# EAGLE design fencerSMD (EAGLE 8.1.0)
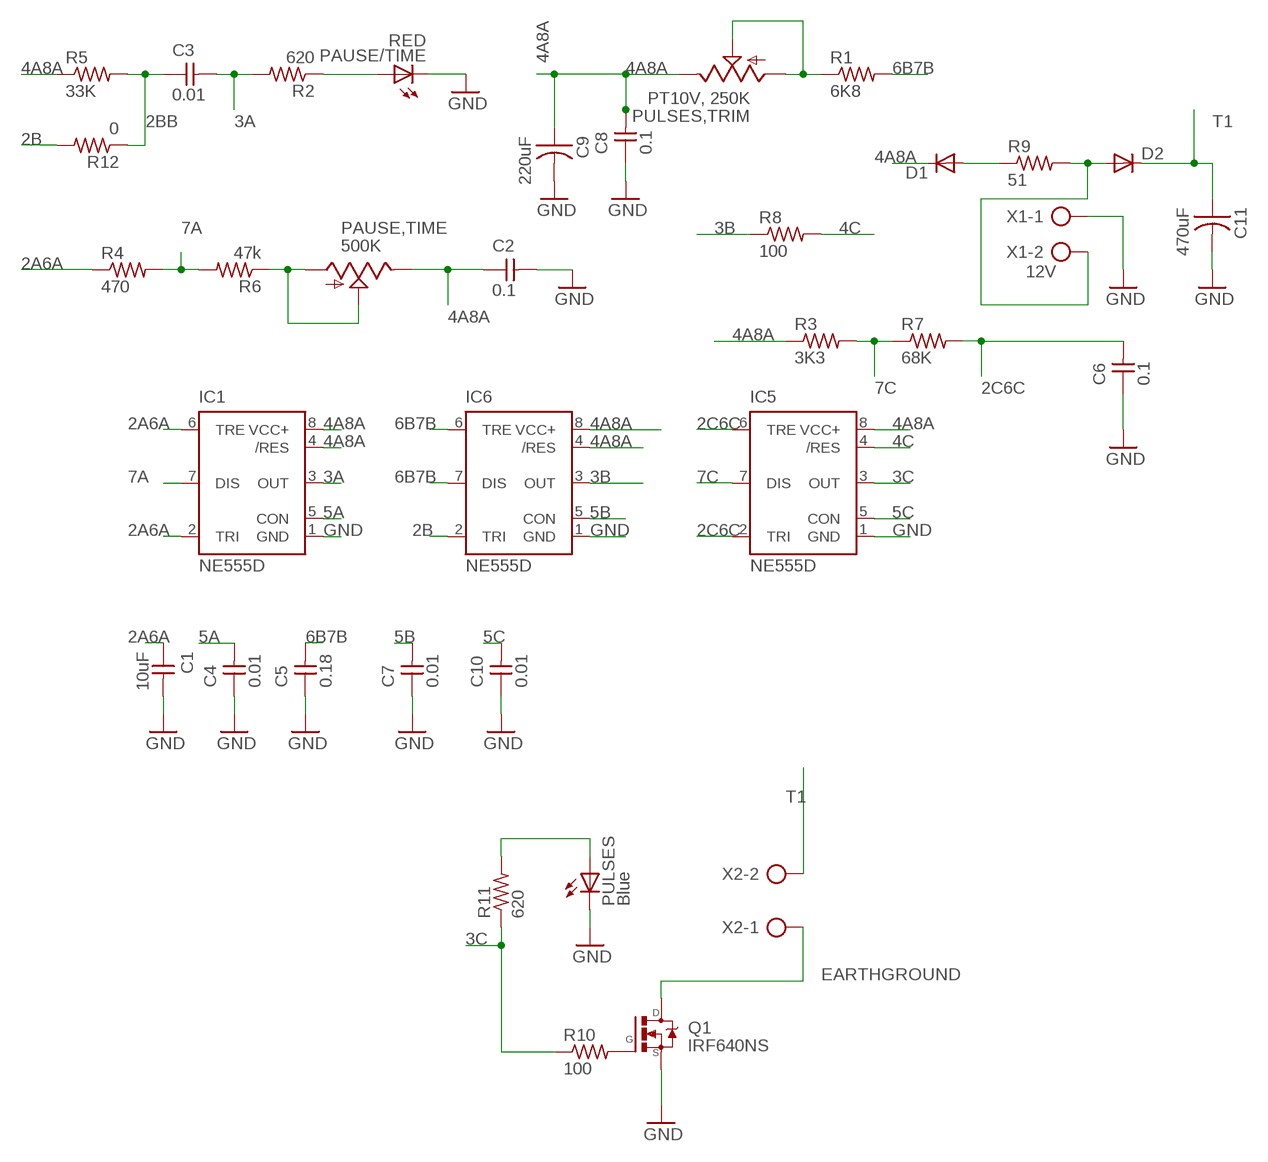
[diagram p0: schematic, sheet 1]

## Parts
C1  10uF  UNPOLARIZED_CAPACITOR1206  [1206]
C2  0.1  UNPOLARIZED_CAPACITOR1206  [1206]
C3  0.01  UNPOLARIZED_CAPACITOR1206  [1206]
C4  0.01  UNPOLARIZED_CAPACITOR1206  [1206]
C5  0.18  UNPOLARIZED_CAPACITOR1206  [1206]
C6  0.1  UNPOLARIZED_CAPACITOR1206  [1206]
C7  0.01  UNPOLARIZED_CAPACITOR1206  [1206]
C8  0.1  UNPOLARIZED_CAPACITOR1206  [1206]
C9  220uF  CAP-US1206  [C1206]
C10  0.01  UNPOLARIZED_CAPACITOR1206  [1206]
C11  470uF  CAP-US1206  [C1206]
D1  DIODESOD123  [SOD123]
D2  DIODESOD123  [SOD123]
IC1  NE555D  [SO08]
IC5  NE555D  [SO08]
IC6  NE555D  [SO08]
PAUSE,TIME  500K  TRIM  [6MM]
PAUSE/TIME  RED  LEDFAB1206  [LED1206FAB]
PULSES  Blue  LEDFAB1206  [LED1206FAB]
PULSES,TRIM  PT10V, 250K  TRIM  [6MM]
Q1  IRF640NS  [D2PAK]
R1  6K8  RESISTOR1206  [1206]
R2  620  RESISTOR1206  [1206]
R3  3K3  RESISTOR1206  [1206]
R4  470  RESISTOR1206  [1206]
R5  33K  RESISTOR1206  [1206]
R6  47k  RESISTOR1206  [1206]
R7  68K  RESISTOR1206  [1206]
R8  100  RESISTOR1206  [1206]
R9  51  RESISTOR1206  [1206]
R10  100  RESISTOR1206  [1206]
R11  620  RESISTOR1206  [1206]
R12  0  RESISTOR1206  [1206]
X1  12V  AK500/2-H  [AK500/2-H]
X2  AK500/2-H  [AK500/2-H]

## Nets
2A6A: C1.1 IC1.2(TRI) IC1.6(TRE) R4.1
2B: IC6.2(TRI) R12.2
2BB: C3.1 R5.2 R12.1
2C6C: C6.2 IC5.2(TRI) IC5.6(TRE) R7.2
3A: C3.2 IC1.3(OUT) R2.2
3B: IC6.3(OUT) R8.1
3C: IC5.3(OUT) R10.1 R11.1
4A8A: C2.1 C8.2 C9.1 D1.CATHODE(C) IC1.4(/RES) IC1.8(VCC+) IC5.8(VCC+) IC6.4(/RES) IC6.8(VCC+) PAUSE,TIME.E PULSES,TRIM.E R3.1 R5.1
4C: IC5.4(/RES) R8.2
5A: C4.2 IC1.5(CON)
5B: C7.2 IC6.5(CON)
5C: C10.2 IC5.5(CON)
6B7B: C5.2 IC6.6(TRE) IC6.7(DIS) R1.2
7A: IC1.7(DIS) R4.2 R6.2
7C: IC5.7(DIS) R3.2 R7.1
ACC: D2.ANODE(A) R9.2 X1.2
EARTHGROUND: Q1.2(D) X2.1
GND: C1.2 C2.2 C4.1 C5.1 C6.1 C7.1 C8.1 C9.2 C10.1 C11.2 IC1.1(GND) IC5.1(GND) IC6.1(GND) PAUSE/TIME.2(C) PULSES.2(C) Q1.3(S) X1.1
N$1: PULSES,TRIM.A PULSES,TRIM.S R1.1
N$2: PAUSE/TIME.1(A) R2.1
N$3: D1.ANODE(A) R9.1
N$4: PAUSE,TIME.A PAUSE,TIME.S R6.1
N$6: PULSES.1(A) R11.2
N$8: Q1.1(G) R10.2
T1: C11.1 D2.CATHODE(C) X2.2

## Library data of the parts
C1-C8 C10 = 01_FAB_Hello:UNPOLARIZED_CAPACITOR: unpolarized_capacitor
C9 C11 = fab (1):CAP-US
D1 D2 = fab (1):DIODE: DIODE high speed (Philips)
IC1 IC5 IC6 = SparkFun-AnalogIC:NE555: General purpose bipolar Timer
PAUSE,TIME PULSES,TRIM = adafruit:TRIM
PAUSE/TIME PULSES = fab (1):LED: LED
Q1 = IRF640:IRF640: HEXFET Power MOSFET; AVAILABILITY: Unavailable; DESCRIPTION: Transistor MOS IRF640 COMSET RoHS TO220; MF: Comset Semiconductors; MP: IRF640; PACKAGE: TO-220 Comset Semiconductors; PRICE: None
R1-R12 = 01_FAB_Hello:RESISTOR
X1 X2 = con-ptr500:AK500/2-H: CONNECTOR Aug. 2004 / PTR Meßtechnik: Die Bezeichnung der Serie AK505 wurde geändert. Es handelt sich hierbei um AK500 in horizontaler Ausführung.; OC_FARNELL: unknown; OC_NEWARK: unknown

## Board
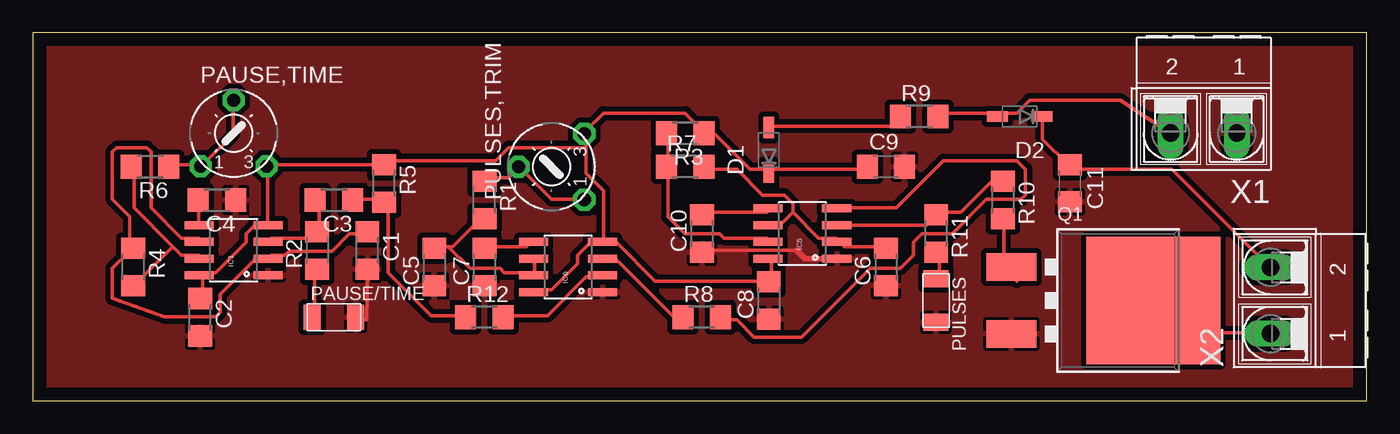
[diagram p1: board, top side]

Size 101.27 x 27.93 mm. Coordinates in mm from the lower left corner, seen from the top.
Outline: 0,0 101.27,0 101.27,27.93 0,27.93 0,0
Copper layers (1*16): Top 0.035mm / dielectric 1.5mm / Bottom 0.035mm
Design rules "default *": minimum track width 10mil, minimum drill 24mil, track to track 0.4mm, track to pad 0.4mm, pad to pad 0.4mm, via to via 0.4mm, smd to smd 0.4mm, copper to edge 40mil, drill to drill 8mil, minimum pad ring 10mil, minimum via ring 8mil, stop-mask expansion 4mil, vias tented up to drill 0mil, thermal gap 10mil

### Footprints (pad centres in the part's own frame; a part is rotated, then mirrored left to right if it is on the bottom)
1206 = smd 1.6 x 1.803: 1 -1.422,0; 2 1.422,0
C1206 = smd 1.6 x 1.8: 1 -1.4,0; 2 1.4,0
SOD123 = smd 1.6 x 0.8: ANODE 1.7,0; CATHODE -1.7,0
SO08 = smd 0.61 x 2.21: 1 -1.905,-2.616; 2 -0.635,-2.616; 3 0.635,-2.616; 4 1.905,-2.616; 5 1.905,2.616; 6 0.635,2.616; 7 -0.635,2.616; 8 -1.905,2.616
6MM = drill 1 pad 1.676 octagon: A -2.5,-2.5; E 2.5,-2.5; S 0,2.5
LED1206FAB = smd 1.27 x 1.905: 1 -1.651,0; 2 1.651,0
D2PAK = smd 2.08 x 3.81: 1 -2.54,-8.255; 3 2.54,-8.255 | smd 9.652 x 10.16: 2 0,2.54
AK500/2-H = drill 1.321 long: 1 -2.515,0; 2 2.515,0

### Placement (x,y rotation side)
C1  25.4,11.43 270 top
C2  12.7,6.35 270 top
C3  22.86,15.24 180 top
C4  13.97,15.24 180 top
C5  30.48,10.16 90 top
C6  64.77,10.16 90 top
C7  34.29,10.16 90 top
C8  55.88,7.62 90 top
C9  64.77,17.78 0 top
C10  50.8,12.7 90 top
C11  78.74,16.51 270 top
D1  55.88,19.05 90 top
D2  74.93,21.59 180 top
IC1  15.24,11.43 90 top
IC5  58.42,12.7 90 top
IC6  40.64,10.16 90 top
PAUSE,TIME  15.24,20.32 0 top
PAUSE/TIME  22.86,6.35 0 top
PULSES  68.58,7.62 270 top
PULSES,TRIM  39.37,17.78 90 top
Q1  82.55,7.62 270 top
R1  34.29,15.24 270 top
R2  21.59,11.43 90 top
R3  49.53,20.32 180 top
R4  7.62,10.16 270 top
R5  26.67,16.51 270 top
R6  8.89,17.78 180 top
R7  49.53,17.78 0 top
R8  50.8,6.35 0 top
R9  67.31,21.59 0 top
R10  73.66,15.24 270 top
R11  68.58,12.7 270 top
R12  34.29,6.35 0 top
X1  88.9,20.32 180 top
X2  93.98,7.62 90 top

### Tracks (layer width: path | path; a pad name or v marks a point on that pad's centre or on a via)
2A6A
  Top 0.254: C1.1 25.33,12.68 24.02,12.68 22.72,11.38 19.45,11.38 19.12,11.05 18.14,11.05 IC1.2 17.81,10.72 16.83,10.72 14.21,8.11 14.21,6.72 13.89,6.39 9.96,6.39 6.04,7.78 6.04,10.07 7.35,11.38 R4.1 7.35,11.7 7.35,13.99 6.04,15.3 6.04,18.9 6.37,19.22 8.65,19.22 8.98,18.9 8.98,14.65 11.27,12.36 12.58,12.36 IC1.6
2B
  Top 0.254: R12.2 35.8,6.47 39.07,6.47 42.01,9.41 42.99,9.41 IC6.2
2BB
  Top 0.254: C3.1 24.35,15.3 26.64,15.3 R5.2 26.97,14.97 26.97,9.74 30.24,6.47 32.85,6.47 R12.1
2C6C
  Top 0.254: C6.2 64.57,11.7 61.63,11.7 61.3,12.03 IC5.2 60.97,12.36 59.67,12.36 57.7,14.32 | 57.7,14.32 57.7,14.97 57.05,15.63 55.41,15.63 53.45,17.59 51.16,17.59 R7.2 | 57.7,14.32 56.72,13.34 56.07,13.34 IC5.6
3A
  Top 0.254: C3.2 21.73,14.97 21.73,13.01 R2.2 21.41,12.68 21.08,12.36 18.14,12.36 IC1.3
3B
  Top 0.254: R8.1 49.2,6.47 48.55,6.47 44.3,10.72 43.32,10.72 IC6.3
3C
  Top 0.254: R10.1 73.4,16.61 72.75,16.61 70.46,14.32 68.82,14.32 R11.1 68.5,13.99 67.84,13.34 61.3,13.34 IC5.3
4A8A
  Top 0.254: IC5.8 56.07,10.72 56.07,9.09 C8.2 55.74,9.09 47.24,9.09 44.3,12.03 43.32,12.03 IC6.4 | IC6.8 38.08,8.43 39.39,8.43 41.35,10.39 41.35,11.05 42.34,12.03 42.99,12.03 IC6.4 | 42.01,19.22 42.01,17.26 43.32,15.95 43.32,12.36 IC6.4 | 42.01,19.22 42.01,20.21 PULSES,TRIM.E 42.01,20.53 43.32,21.84 49.53,21.84 50.84,20.53 R3.1 51.16,20.21 51.82,20.21 54.43,17.59 55.74,17.59 D1.CATHODE 56.07,17.59 63.26,17.59 C9.1 | 42.01,19.22 36.12,19.22 35.14,18.24 26.97,18.24 R5.1 26.64,17.92 17.81,17.92 PAUSE,TIME.E 17.81,17.59 17.81,13.34 | C2.1 12.9,7.78 12.9,9.41 IC1.8 12.9,9.74 13.89,9.74 16.17,12.03 16.17,12.68 16.83,13.34 17.81,13.34 | 17.81,13.34 IC1.4
4C
  Top 0.254: R8.2 52.47,6.14 53.45,6.14 54.76,4.84 58.36,4.84 63.59,10.07 65.88,10.07 66.86,11.05 66.86,12.03 67.51,12.68 69.8,12.68 72.42,15.3 75.03,15.3 75.36,15.63 75.36,17.59 74.71,18.24 69.15,18.24 65.55,14.65 61.3,14.65 IC5.4
5A
  Top 0.254: C4.2 12.58,14.97 12.58,13.34 IC1.5
5B
  Top 0.254: C7.2 34.49,11.7 37.43,11.7 37.76,12.03 IC6.5
5C
  Top 0.254: C10.2 50.84,14.32 55.74,14.32 IC5.5
6B7B
  Top 0.254: IC6.6 38.08,10.72 38.08,9.74 IC6.7 37.76,9.74 35.8,9.74 35.47,10.07 33.18,10.07 31.54,11.7 | 31.54,11.7 31.87,11.7 34.16,13.99 R1.2 | 31.54,11.7 30.56,11.7 C5.2
7A
  Top 0.254: 10.62,11.7 11.27,11.05 12.58,11.05 IC1.7 | 10.62,11.7 7.67,14.65 7.67,17.59 R6.2 | 10.62,11.7 7.67,8.76 R4.2
7C
  Top 0.254: R3.2 48.22,20.21 48.22,17.92 R7.1 48.22,17.59 48.22,13.99 49.53,12.68 52.15,12.68 52.47,12.36 55.74,12.36 IC5.7
ACC
  Top 0.254: R9.2 68.82,21.84 73.07,21.84 D2.ANODE 73.4,21.84 74.71,21.84 75.69,22.82 82.56,22.82 X1.2
EARTHGROUND
  Top 0.254: X2.1 93.67,5.16 87.46,5.16 85.17,7.45 Q1.2
GND
  Top 0.254: C1.2 25.33,6.14 25.2,6.14 | 50.95,11.43 57.99,11.43
  Top 0.406: C10.1 50.95,11.43 | 57.99,11.43 58.62,10.79 IC5.1
  pour Top: 0,29.21 102.87,29.21 102.87,0 0,0
N$1
  Top 0.254: R1.1 34.49,16.93 36.12,16.93 36.78,17.59 PULSES,TRIM.S 37.1,17.59 39.39,15.3 41.68,15.3 PULSES,TRIM.A
N$2
  Top 0.254: R2.1 21.41,9.74 21.41,6.47 PAUSE/TIME.1
N$3
  Top 0.254: D1.ANODE 56.07,20.86 65.23,20.86 65.88,21.51 R9.1
N$4
  Top 0.254: R6.1 10.62,17.92 12.58,17.92 PAUSE,TIME.A 12.9,17.92 15.19,20.21 15.19,22.49 PAUSE,TIME.S
N$6
  Top 0.254: R11.2 68.82,11.05 68.82,9.41 PULSES.1
N$8
  Top 0.254: R10.2 73.73,13.67 73.73,10.07 74.71,9.09 Q1.1
T1
  Top 0.254: D2.CATHODE 76.67,21.51 76.67,19.88 78.63,17.92 C11.1 78.96,17.59 86.48,17.59 93.67,10.39 X2.2